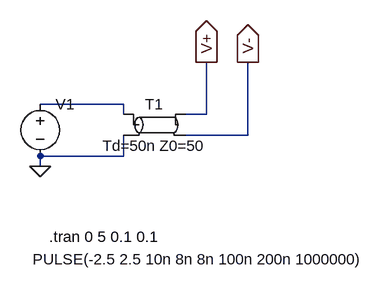
[diagram p0: schematic Draft1.asc]
Draft1.asc, the LTspice schematic file:
Version 4
SHEET 1 880 680
WIRE 112 64 -16 64
WIRE 112 80 112 64
WIRE 240 80 240 0
WIRE 240 80 208 80
WIRE 304 112 304 0
WIRE 304 112 208 112
WIRE 112 144 112 112
WIRE 112 144 -16 144
WIRE -16 160 -16 144
FLAG -16 160 0
FLAG 240 0 V+
IOPIN 240 0 Out
FLAG 304 0 V-
IOPIN 304 0 Out
SYMBOL tline 160 96 R0
SYMATTR InstName T1
SYMBOL voltage -16 48 R0
WINDOW 3 -12 255 Left 2
WINDOW 123 0 0 Left 0
WINDOW 39 0 0 Left 0
SYMATTR InstName V1
SYMATTR Value PULSE(-2.5 2.5 10n 8n 8n 100n 200n 1000000)
TEXT -2 268 Left 2 !.tran 0 5 0.1 0.1

The netlist it stands for:
* Draft1.asc
T1 N001 0 V+ V- Td=50n Z0=50
V1 N001 0 PULSE(-2.5 2.5 10n 8n 8n 100n 200n 1000000)
.tran 0 5 0.1 0.1
.backanno
.end